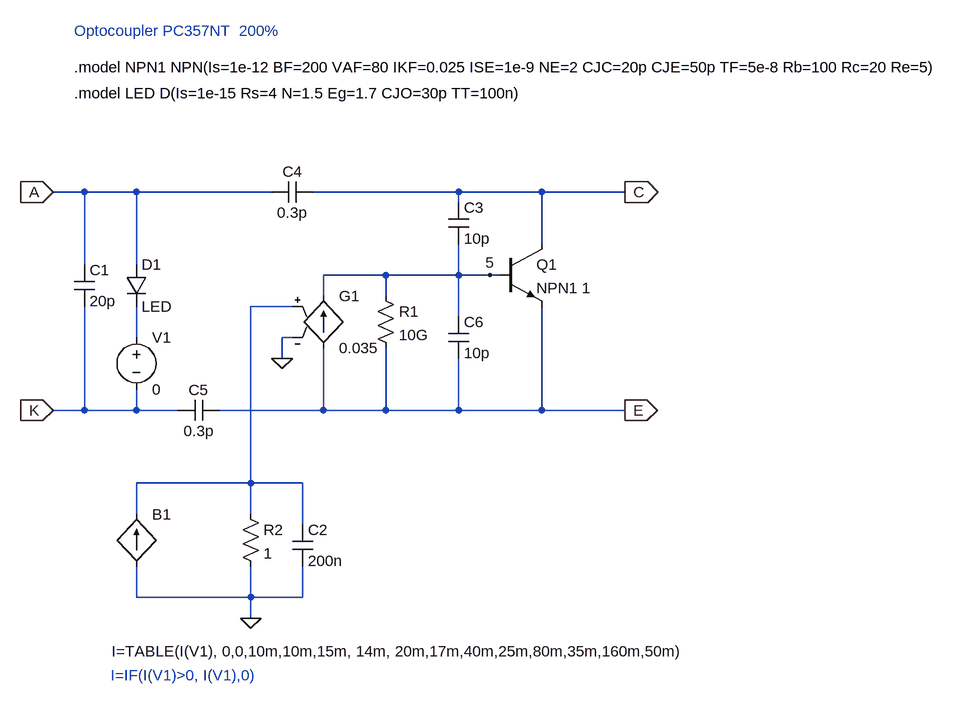
[diagram p0: schematic pc357nth.asc]
pc357nth.asc, the LTspice schematic file:
Version 4
SHEET 1 1616 872
WIRE -16 224 -16 112
WIRE -16 112 -96 112
WIRE -16 288 -16 336
WIRE -16 448 -96 448
WIRE 608 192 608 112
WIRE 608 288 608 448
WIRE 608 448 736 448
WIRE 608 112 736 112
WIRE 544 240 528 240
WIRE 528 240 480 240
WIRE 368 352 368 448
WIRE 368 448 480 448
WIRE -96 224 -96 112
WIRE -96 288 -96 448
WIRE -96 448 -144 448
WIRE -96 112 -144 112
WIRE -16 416 -16 448
WIRE 272 272 272 240
WIRE 272 240 368 240
WIRE 272 352 272 448
WIRE 272 448 368 448
WIRE 160 608 160 560
WIRE 160 560 240 560
WIRE 240 560 240 624
WIRE 160 688 160 736
WIRE 160 736 240 736
WIRE 240 736 240 688
WIRE 160 768 160 736
WIRE -16 608 -16 560
WIRE -16 560 160 560
WIRE 160 736 -16 736
WIRE -16 736 -16 688
WIRE 224 336 208 336
WIRE 208 336 208 368
WIRE 224 288 160 288
WIRE 160 288 160 560
WIRE 480 192 480 240
WIRE 480 128 480 112
WIRE 480 112 608 112
WIRE 256 112 480 112
WIRE 192 112 -16 112
WIRE -16 448 48 448
WIRE 112 448 272 448
WIRE 480 240 368 240
WIRE 368 240 368 272
WIRE 480 304 480 240
WIRE 480 368 480 448
WIRE 480 448 608 448
FLAG -144 112 A
IOPIN -144 112 In
FLAG -144 448 K
IOPIN -144 448 In
FLAG 736 448 E
IOPIN 736 448 Out
FLAG 736 112 C
IOPIN 736 112 Out
FLAG 528 240 5
FLAG 160 768 0
FLAG 208 368 0
SYMBOL diode -32 224 R0
SYMATTR InstName D1
SYMATTR Value LED
SYMBOL npn 544 192 R0
SYMATTR InstName Q1
SYMATTR Value NPN1 1
SYMBOL res 352 256 R0
SYMATTR InstName R1
SYMATTR Value 10G
SYMBOL cap -112 224 R0
SYMATTR InstName C1
SYMATTR Value 20p
SYMBOL voltage -16 320 R0
SYMATTR InstName V1
SYMATTR Value 0
SYMBOL res 144 592 R0
SYMATTR InstName R2
SYMATTR Value 1
SYMBOL cap 224 624 R0
SYMATTR InstName C2
SYMATTR Value 200n
SYMBOL bi2 -16 608 R0
WINDOW 3 -38 211 Left 0
SYMATTR Value I=TABLE(I(V1), 0,0,10m,10m,15m, 14m, 20m,17m,40m,25m,80m,35m,160m,50m)
SYMATTR InstName B1
SYMBOL g 272 256 R0
SYMATTR InstName G1
SYMATTR Value 0.035
SYMBOL cap 464 128 R0
SYMATTR InstName C3
SYMATTR Value 10p
SYMBOL cap 192 128 R270
WINDOW 0 32 32 VTop 0
WINDOW 3 0 32 VBottom 0
SYMATTR InstName C4
SYMATTR Value 0.3p
SYMBOL cap 48 464 R270
WINDOW 0 32 32 VTop 0
WINDOW 3 0 32 VBottom 0
SYMATTR InstName C5
SYMATTR Value 0.3p
SYMBOL cap 464 304 R0
SYMATTR InstName C6
SYMATTR Value 10p
TEXT -112 -40 Left 0 !.model LED D(Is=1e-15 Rs=4 N=1.5 Eg=1.7 CJO=30p TT=100n)
TEXT -112 -80 Left 0 !.model NPN1 NPN(Is=1e-12 BF=200 VAF=80 IKF=0.025 ISE=1e-9 NE=2 CJC=20p CJE=50p TF=5e-8 Rb=100 Rc=20 Re=5)
TEXT -112 -136 Left 0 ;Optocoupler PC357NT  200%
TEXT -56 856 Left 0 ;I=IF(I(V1)>0, I(V1),0)

The netlist it stands for:
* pc357nth.asc
D1 A N001 LED
Q1 C 5 E 0 NPN1 1
R1 5 E 10G
C1 A K 20p
V1 N001 K 0
R2 N002 0 1
C2 N002 0 200n
B1 0 N002 I=TABLE(I(V1), 0,0,10m,10m,15m, 14m, 20m,17m,40m,25m,80m,35m,160m,50m)
G1 E 5 N002 0 0.035
C3 C 5 10p
C4 A C 0.3p
C5 K E 0.3p
C6 5 E 10p
.model D D
.lib standard.dio
.model NPN NPN
.model PNP PNP
.lib standard.bjt
.model LED D(Is=1e-15 Rs=4 N=1.5 Eg=1.7 CJO=30p TT=100n)
.model NPN1 NPN(Is=1e-12 BF=200 VAF=80 IKF=0.025 ISE=1e-9 NE=2 CJC=20p CJE=50p TF=5e-8 Rb=100 Rc=20 Re=5)
* Optocoupler PC357NT  200%
* I=IF(I(V1)>0, I(V1),0)
.backanno
.end